# Altium project EFNMR_POLARIZATION_V1.PrjPcb
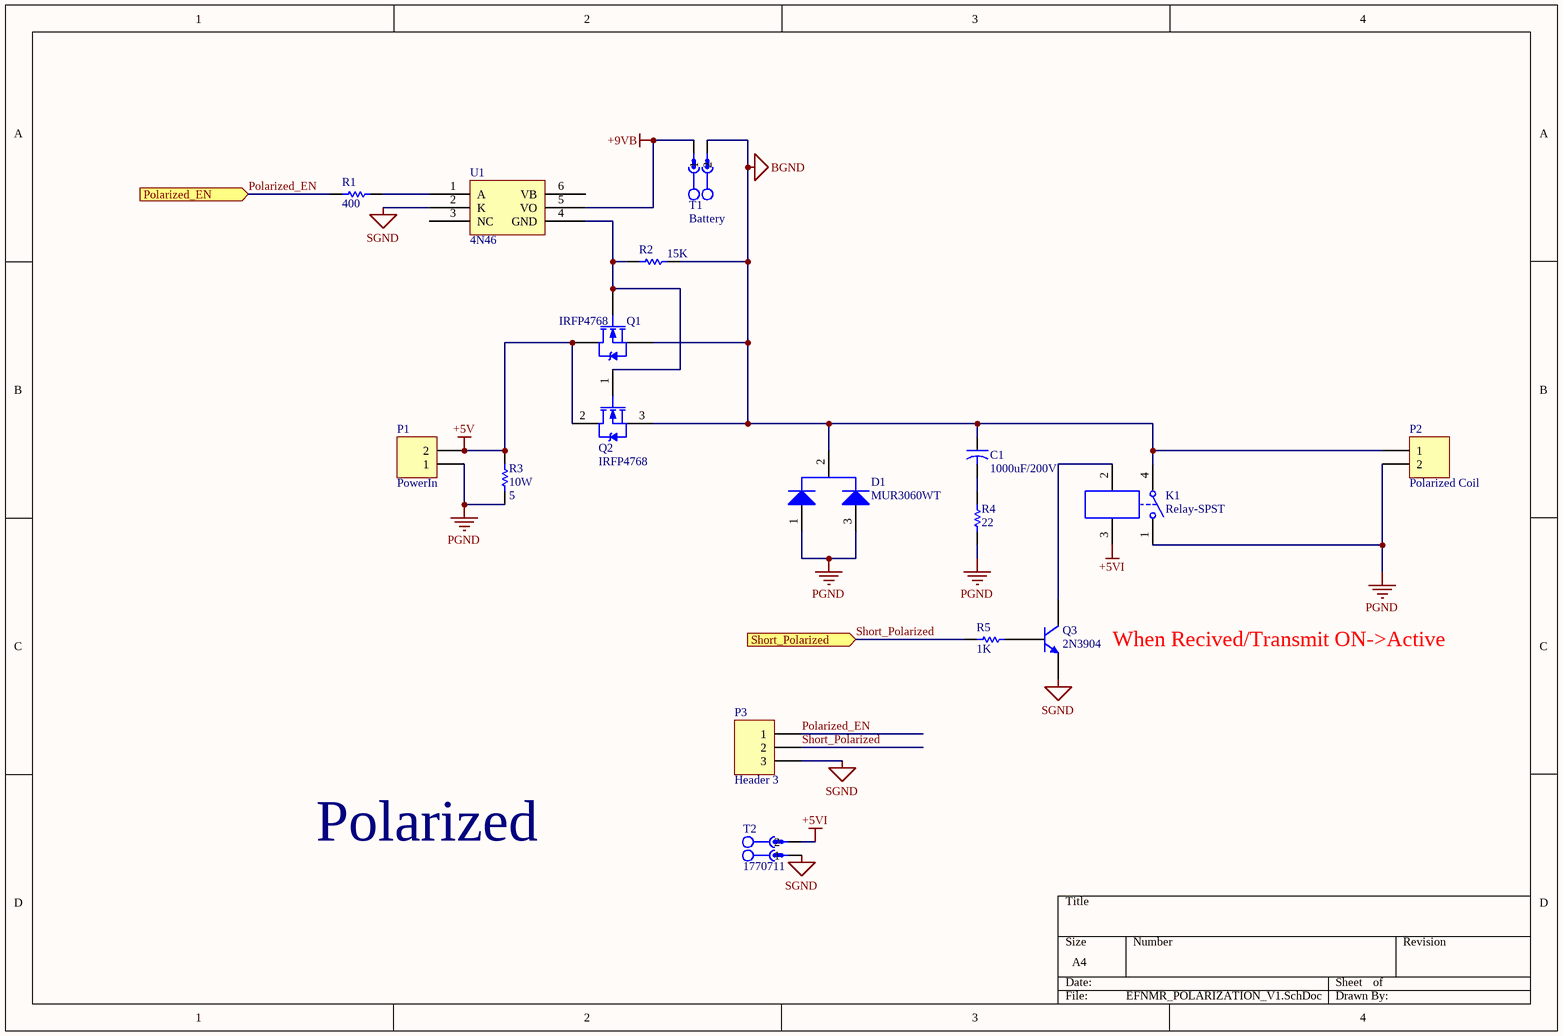
[diagram p0: EFNMR_POLARIZATION_V1.SchDoc]
1 sheet, 17 parts. Net scope: flat (ports and power ports of the same name join across sheets).
Board file: EFNMR_POLARIZATION_V1.PcbDoc

## Sheet EFNMR_POLARIZATION_V1.SchDoc
size A4

### Parts
C1  1000uF/200V  [Cap electrolitic radial 13x25-5]
D1  MUR3060WT  [TO-247AC]
K1  Relay-SPST  [HE3351A0500]
P1  PowerIn  [KF35C 2PIN]
P2  Polarized Coil  [KF35C 2PIN]
P3  Header 3  [DS1070-3-COMCON]
Q1  IRFP4768  [TO-247AC]
Q2  IRFP4768  [TO-247AC]
Q3  2N3904  [TO-92A]
R1  400  [Axial 0_25 W, 0_4 IN LEAD PITCH]
R2  15K  [Axial 0_25 W, 0_4 IN LEAD PITCH]
R3  10W  value 5  [Axial 3W 9_0mm]
R4  22  [Axial 1W  7_0mm]
R5  1K  [Axial 0_25 W, 0_4 IN LEAD PITCH]
T1  Battery  [MSTB 2,5/2-G-5,08]
T2  1770711  [MSTB 2,5/2-G-5,08]
U1  4N46  [DIP-6]

### Ports
Polarized_EN (in), Short_Polarized (in)

### Nets
+5V: P1.2 Q1.2(D) Q2.2(D) R3.2
+5VI: K1.3 T2.2
+9VB: T1.1 U1.5(VO)
BGND: C1.1 D1.2(K) K1.4 P2.1 Q1.3(S) Q2.3(S) R2.2 T1.2
PGND: D1.1(A1) D1.3(A2) K1.1 P1.1 P2.2 R3.1 R4.1
SGND: P3.3 Q3.1(E) T2.1 U1.2(K)
Polarized_EN: P3.1 R1.2 ; port Polarized_EN
Short_Polarized: P3.2 R5.2 ; port Short_Polarized
NetC1_2: C1.2 R4.2
NetK1_2: K1.2 Q3.3(C)
NetQ1_1: Q1.1(G) Q2.1(G) R2.1 U1.4(GND)
NetQ3_2: Q3.2(B) R5.1
NetR1_1: R1.1 U1.1(A)

Not connected (* = marked no-connect by the designer): U1 3(NC) 6(VB)

### Notes on the sheet
- When Recived/Transmit ON->Active
- Polarized

### Library data of the parts
C1 = Cap2: Capacitor; Published: 23-Sep-2002; PackageReference: CAPR5-4X5; Publisher: Altium Limited; PackageDescription: Capacitor; 2 Leads; Value: 1000uF/200V
D1 = MUR3060WT: SWITCHMODE(TM) Power Rectifier, 3-Pin TO-247, Tube; Manufacturer: On Semiconductor; IFSM Max (A): 150; Type: Ultrafast; VRRM Max (V): 600; DatasheetVersion: Rev. 6; PackageVersion: Rev. F, 10/2011; PackageReference: TO-247-3-340L-02; PackageDescription: 3-Pin Flange Mount, Vertical Straight Lead, Body 16.005 x 5 mm, Pitch 5.45 mm; Supplier 1: Digi-Key; Supplier Part Number 1: MUR3060WTOS-ND; Packing: Tube; RoHS: FALSE; Mounting Technology: Through Hole; PartNumber: MUR3060WT; ComponentLink1Description: Manufacturer URL; ComponentLink1URL: http://www.onsemi.com/; ComponentLink2Description: Datasheet; ComponentLink2URL: http://www.onsemi.cn/pub_link/Collateral/MUR3020WT-D.PDF; ComponentLink3Description: Package Specification; ComponentLink3URL: http://www.onsemi.cn/pub_link/Collateral/340L-02.PDF
K1 = Relay-SPST: Single-Pole Single-Throw Relay; Published: 24-Mar-1999; LatestRevisionDate: 17-Jul-2002; LatestRevisionNote: Re-released for DXP Platform.; PackageReference: MODULE4; Publisher: Altium Limited
P1 P2 = Header 2: Header, 2-Pin; LatestRevisionDate: 17-Jul-2002; LatestRevisionNote: Re-released for DXP Platform.; Publisher: Altium Limited
P3 = Header 3: Header, 3-Pin; LatestRevisionDate: 17-Jul-2002; LatestRevisionNote: Re-released for DXP Platform.; Publisher: Altium Limited
Q1 Q2 = IRFP450: HEXFET Power MOSFET; Note: Pin 2 is electrically connected to the Heatsink (4).; Published: 8-Jun-2000; LatestRevisionDate: 17-Jul-2002; LatestRevisionNote: Re-released for DXP Platform.; DatasheetVersion: PD-9.458C; PackageVersion: Aug-1997; PackageReference: TO-247AC; Publisher: Altium Limited; PackageDescription: SIP with Mounting Hole; 3 Leads; Body 20 x 15.6 x 5 mm (typ); Pitch 5.45 mm; Code_JEDEC: TO-247-AC; ComponentLink1Description: Manufacturer Link; ComponentLink1URL: http://www.irf.com/; ComponentLink2Description: Datasheet; ComponentLink2URL: http://www.irf.com/product-info/datasheets/data/irfp450.pdf
Q3 = 2N3904: NPN General Purpose Amplifier; Published: 8-Jun-2000; LatestRevisionDate: 15-Jan-2003; LatestRevisionNote: PCB Footprint 'BCY-W3/D4.7' replaced; DatasheetVersion: 1997; PackageVersion: Sep-1998; PackageReference: TO-92A; Publisher: Altium Limited; PackageDescription: TO, Flat Index; 3 In-Line, Axial Leads; Body Dia. 4.5mm; Leads 0.51 x 0.48 mm (max); ComponentLink1Description: Manufacturer Link; ComponentLink1URL: http://www.fairchildsemi.com/; ComponentLink2Description: Datasheet; ComponentLink2URL: http://www.fairchildsemi.com/ds/2N%2F2N3904.pdf
R1-R5 = Res1: Resistor; Published: 8-Jun-2000; LatestRevisionDate: 17-Jul-2002; LatestRevisionNote: Re-released for DXP Platform.; PackageReference: AXIAL-0.3; Publisher: Altium Limited; PackageDescription: Axial Device, Thru-Hole; 2 Leads; 0.3 in Pin Spacing
  R1: Value: 400
  R2: Value: 15K
  R4: Value: 22
  R5: Value: 1K
T1 = CON_Phoenix_MSTB_02: 2 Pitch: 5.08 mm Color: green Contact surface: Tin Assembly; Manufacturer: PHOENIX CONTACT; PART.NO: 1770711; Connector type: PCB Terminal Block; designer: ABBAS BASEREH; Max Current: 12 A; Positions: 2; Voltage: 320 V; Category: Connector; ComponentLink1Description: Header, Nominal current: 12 A Rated voltage (III/2): 320 V Number of positions: 2 Pitch: 5.08 mm Color: green Contact surface: Tin Assembly: Soldering  DESIGNER:ABBAS BASEREH; ComponentLink2Description: Reference; Mounting Technology: Through-Hole; Pin Count: 2; Revision 1: 2017-3-1; Status: Unreleased
T2 = CON_Phoenix_MSTB_02: 2 Pitch: 5.08 mm Color: green Contact surface: Tin Assembly; Manufacturer: PHOENIX CONTACT; Connector type: PCB Terminal Block; designer: ABBAS BASEREH; Max Current: 12 A; Positions: 2; Voltage: 320 V; Category: Connector; ComponentLink1Description: Header, Nominal current: 12 A Rated voltage (III/2): 320 V Number of positions: 2 Pitch: 5.08 mm Color: green Contact surface: Tin Assembly: Soldering  DESIGNER:ABBAS BASEREH; ComponentLink2Description: Reference; Mounting Technology: Through-Hole; Pin Count: 2; Revision 1: 2017-3-1; Status: Unreleased; PART.NO: 1770711
U1 = 4N46: Optocouplers